# Altium schematic sheet VOLTAGE_TOP.SchDoc
size A3
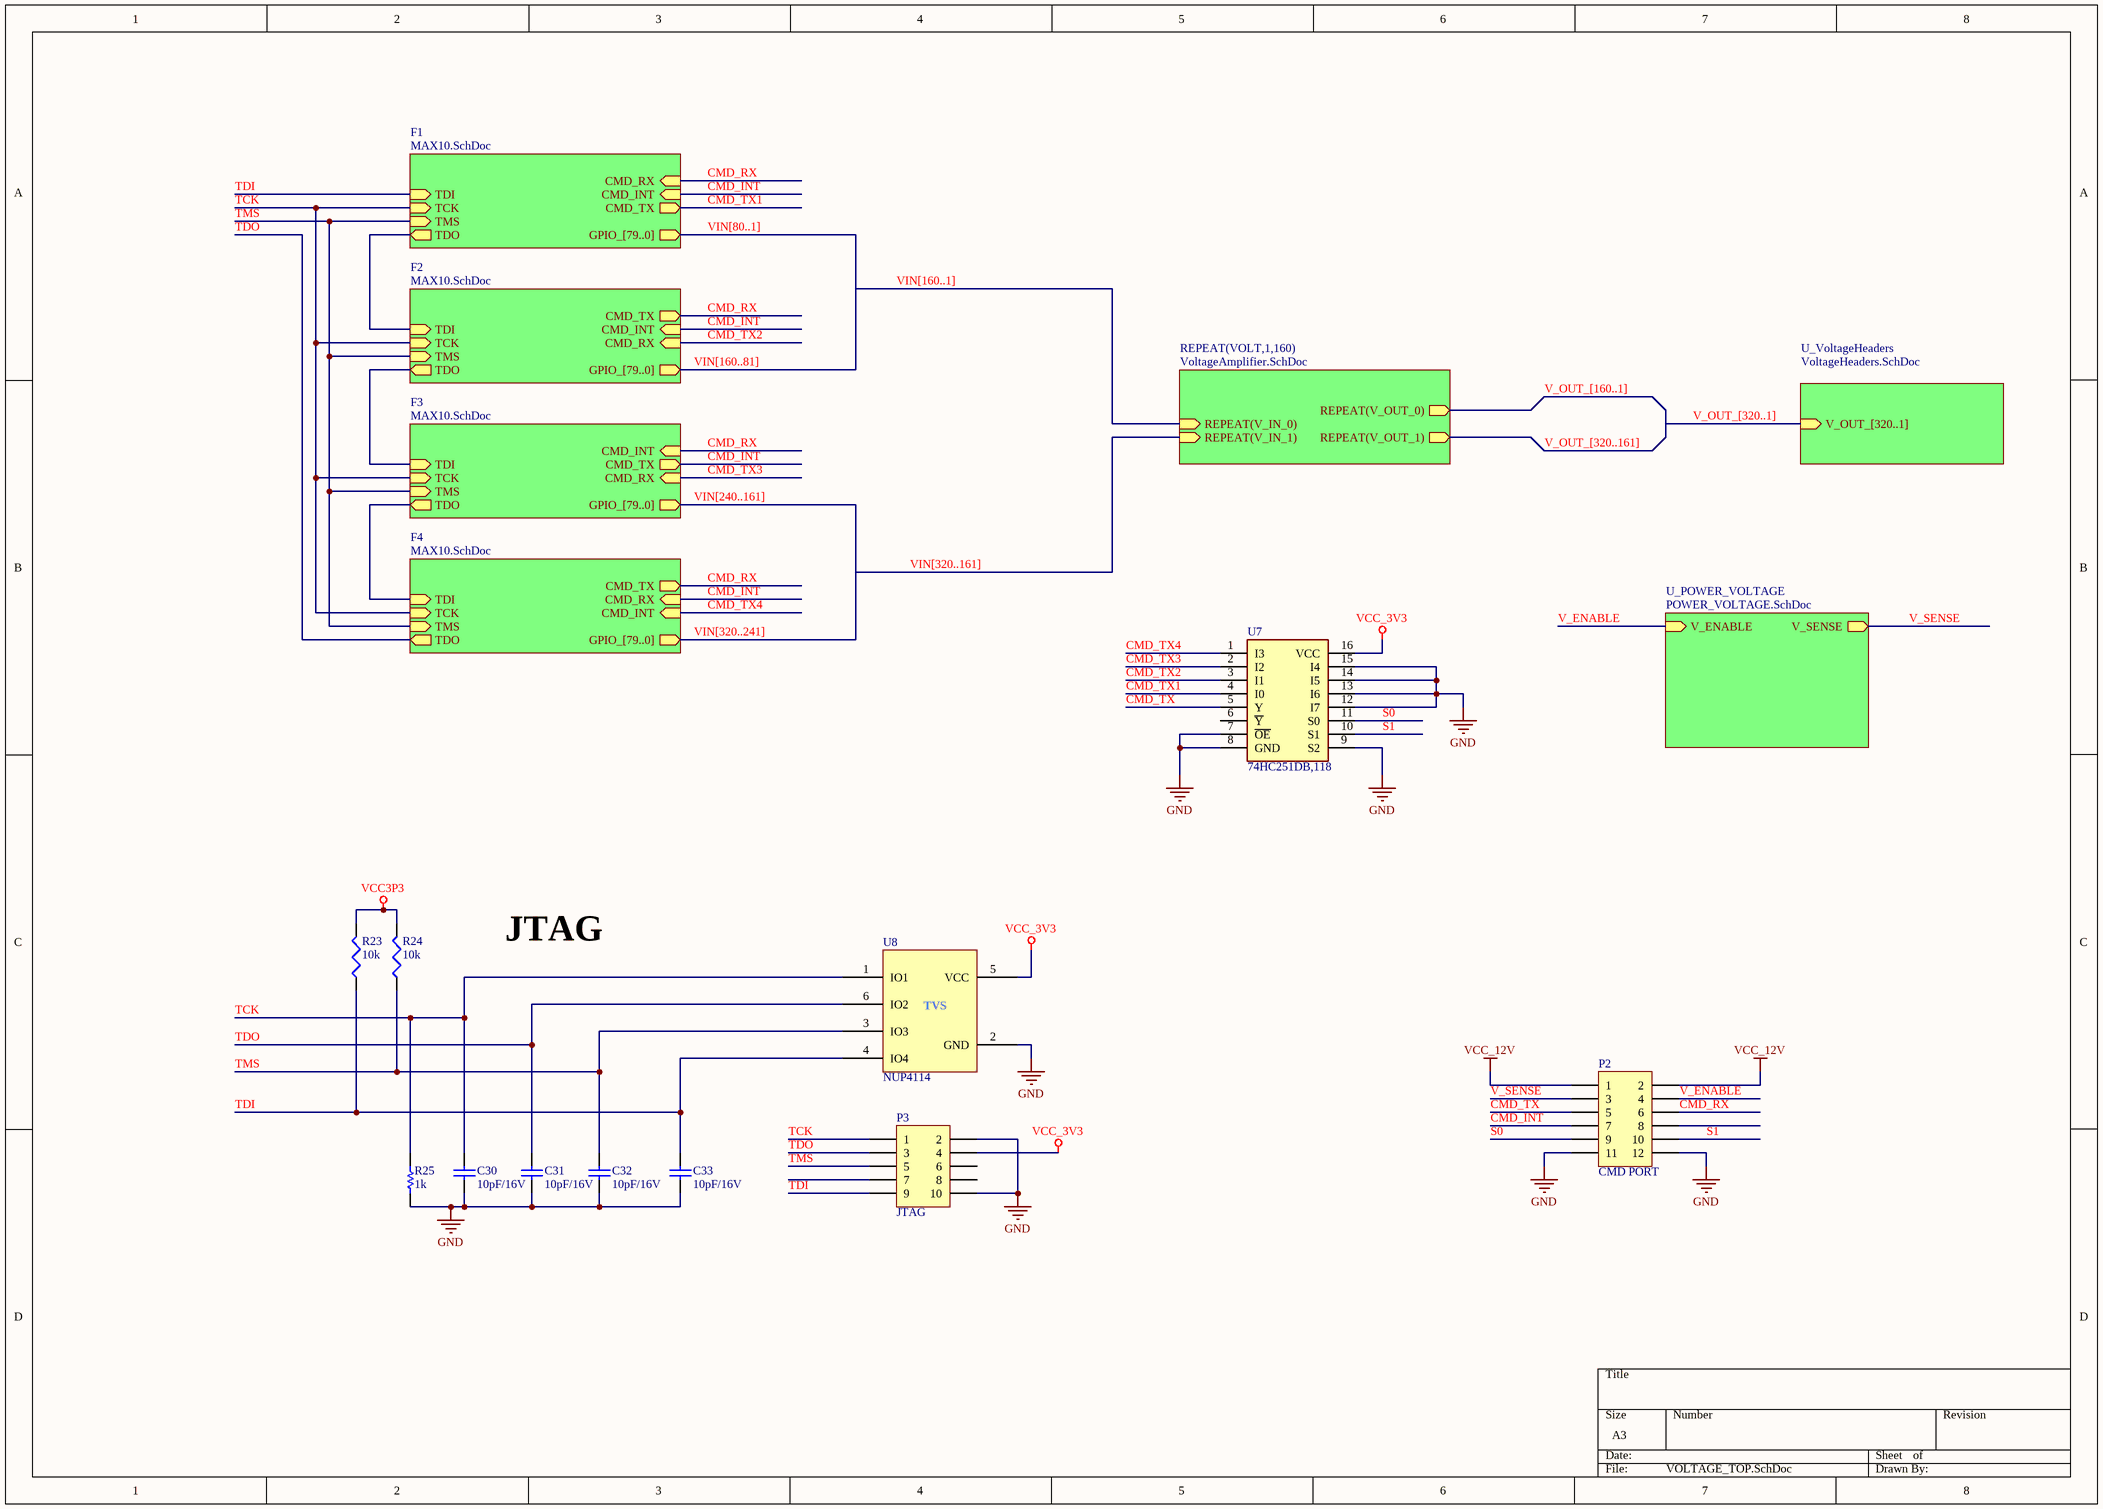
[diagram p0: VOLTAGE_TOP.SchDoc]

## Parts
C30  10pF/16V  [0603_CAP]
C31  10pF/16V  [0603_CAP]
C32  10pF/16V  [0603_CAP]
C33  10pF/16V  [0603_CAP]
P2  CMD PORT  [HDR2X6]
P3  JTAG  [HDR2X5]
R23  10k  [0402_RES]
R24  10k  [0402_RES]
R25  1k  [RES_0805]
U7  74HC251DB,118  [SOP65P775X200-16N]
U8  NUP4114  [NUP4114HMR6T1G]

## Sub-sheets
F1 = MAX10.SchDoc: TDI (in), GPIO_[79..0] (out), TCK (in), TMS (in), TDO (out), CMD_RX (in), CMD_INT (in), CMD_TX (out)
F2 = MAX10.SchDoc: TDI (in), GPIO_[79..0] (out), TCK (in), TMS (in), TDO (out), CMD_TX (out), CMD_INT (in), CMD_RX (in)
F3 = MAX10.SchDoc: TDI (in), GPIO_[79..0] (out), TCK (in), TMS (in), TDO (out), CMD_INT (in), CMD_TX (out), CMD_RX (in)
F4 = MAX10.SchDoc: TDI (in), GPIO_[79..0] (out), TCK (in), TMS (in), TDO (out), CMD_TX (out), CMD_RX (in), CMD_INT (in)
REPEAT(VOLT,1,160) = VoltageAmplifier.SchDoc: REPEAT(V_IN_0) (in), REPEAT(V_OUT_0) (out), REPEAT(V_OUT_1) (out), REPEAT(V_IN_1) (in)
U_POWER_VOLTAGE = POWER_VOLTAGE.SchDoc: V_SENSE (out), V_ENABLE (in)
U_VoltageHeaders = VoltageHeaders.SchDoc: V_OUT_[320..1] (in)

## Nets
GND: C30.1 C31.1 C32.1 C33.1 P2.11 P2.12 P3.2 P3.10 R25.2 U7.7(~{OE}) U7.8(GND) U7.9(S2) U7.12(I7) U7.13(I6) U7.14(I5) U7.15(I4) U8.2(GND)
VCC3P3: R23.2 R24.2
VCC_3V3: P3.4 U7.16(VCC) U8.5(VCC)
VCC_12V: P2.1 P2.2
CMD_INT: P2.7 ; sheet F1/CMD_INT, sheet F2/CMD_INT, sheet F3/CMD_TX, sheet F4/CMD_RX
CMD_RX: P2.6 ; sheet F1/CMD_RX, sheet F2/CMD_TX, sheet F3/CMD_INT, sheet F4/CMD_TX
CMD_TX: P2.5 U7.5(Y)
CMD_TX1: U7.4(I0) ; sheet F1/CMD_TX
CMD_TX2: U7.3(I1) ; sheet F2/CMD_RX
CMD_TX3: U7.2(I2) ; sheet F3/CMD_RX
CMD_TX4: U7.1(I3) ; sheet F4/CMD_INT
S0: P2.9 U7.11(S0)
S1: P2.10 U7.10(S1)
TCK: C30.2 P3.1 R25.1 U8.1(IO1) ; sheet F1/TCK, sheet F2/TCK, sheet F3/TCK, sheet F4/TCK
TDI: C33.2 P3.9 R23.1 U8.4(IO4) ; sheet F1/TDI
TDO: C31.2 P3.3 U8.6(IO2) ; sheet F4/TDO
TMS: C32.2 P3.5 R24.1 U8.3(IO3) ; sheet F1/TMS, sheet F2/TMS, sheet F3/TMS, sheet F4/TMS
V_ENABLE: P2.4 ; sheet U_POWER_VOLTAGE/V_ENABLE
V_OUT_[160..1]: sheet REPEAT(VOLT,1,160)/REPEAT(V_OUT_0)
V_OUT_[320..161]: sheet REPEAT(VOLT,1,160)/REPEAT(V_OUT_1)
V_SENSE: P2.3 ; sheet U_POWER_VOLTAGE/V_SENSE
(unnamed): sheet F1/TDO, sheet F2/TDI
(unnamed): sheet F2/TDO, sheet F3/TDI
(unnamed): sheet F3/TDO, sheet F4/TDI

Not connected (* = marked no-connect by the designer): P2 8; P3 6 7 8; U7 6(~{Y})

## Buses and harness runs
bus V_OUT_[320..1] = sheet U_VoltageHeaders/V_OUT_[320..1]
bus VIN[80..1] = VIN[160..1] = VIN[160..81] = sheet F1/GPIO_[79..0] = sheet F2/GPIO_[79..0]
bus VIN[240..161] = VIN[320..161] = VIN[320..241] = sheet F3/GPIO_[79..0] = sheet F4/GPIO_[79..0]

## Notes on the sheet
- JTAG
- (in symbol NUP4114) TVS

## Library data of the parts
C30-C33 = Cap: Multilayer Ceramic Capacitors MLCC - SMD/SMT 16V 10pF 0603 X7R 0.1; Mfr Part No: C0603C100K4RACTU; Manufacturer: KEMET; Value: 10pF/16V; Stockiest: MOUSER; Stockiest Part No: 80-C0603C100K4RACTU; Package: 0603; Price: 0.1
P2 = Header 6X2: Header, 6-Pin, Dual row; LatestRevisionDate: 17-Jul-2002; LatestRevisionNote: Re-released for DXP Platform.; Publisher: Altium Limited
P3 = Header 5X2: Header, 5-Pin, Dual row; LatestRevisionDate: 17-Jul-2002; LatestRevisionNote: Re-released for DXP Platform.; Publisher: Altium Limited
R23 R24 = 0402_RES: Thick Film Resistors - SMD 10K OHM 1%; Manufacturer: Yageo; Mfr Part No: RC0402FR-0710KL; Package: 0402; Price: 0.1; Stockiest Part No: 603-RC0402FR-0710KL; Value: 10k; Stockiest: MOUSER
R25 = Res1: Thick Film Resistors - SMD 1/16W 1K Ohm 50V 1% ANTI SULFUR AEC-Q200; Mfr Part No: AA0402FR-071KL; Manufacturer: Yageo; Value: 1k; Stockiest: MOUSER; Stockiest Part No: 603-AA0402FR-071KL; Package: 0402; Price: 0.1
U7 = 74HC251DB,118: Integrated Circuit; Manufacturer_Name: Nexperia; Datasheet Link: https://assets.nexperia.com/documents/data-sheet/74HC_HCT251.pdf; Height: 2mm; Manufacturer_Part_Number: 74HC251DB,118; Arrow Part Number: 74HC251DB,118; Arrow Price/Stock: https://www.arrow.com/en/products/74hc251db118/nexperia; Mouser Part Number: 771-HC251DB118; Mouser Price/Stock: https://www.mouser.com/Search/Refine.aspx?Keyword=771-HC251DB118
U8 = NUP4114: ESD Suppressors / TVS Diodes LOW CAP TVS ARRAY 5.5V; Manufacturer: ON Semi; Mfr Part No: NUP4114HMR6T1G; Package: SMD; Price: 0.529; Stockiest: MOUSER; Stockiest Part No: 863-NUP4114HMR6T1G; Value: 5.5V